# EasyEDA schematic SCH_Orto-Idroponico_2021-09-27.json
TITLE: Orto Idroponico; REV: 2.0; Date: 2021-09-27; Sheet: 1/1; Drawn By: francesco-scar; Company: Fablab Imperia
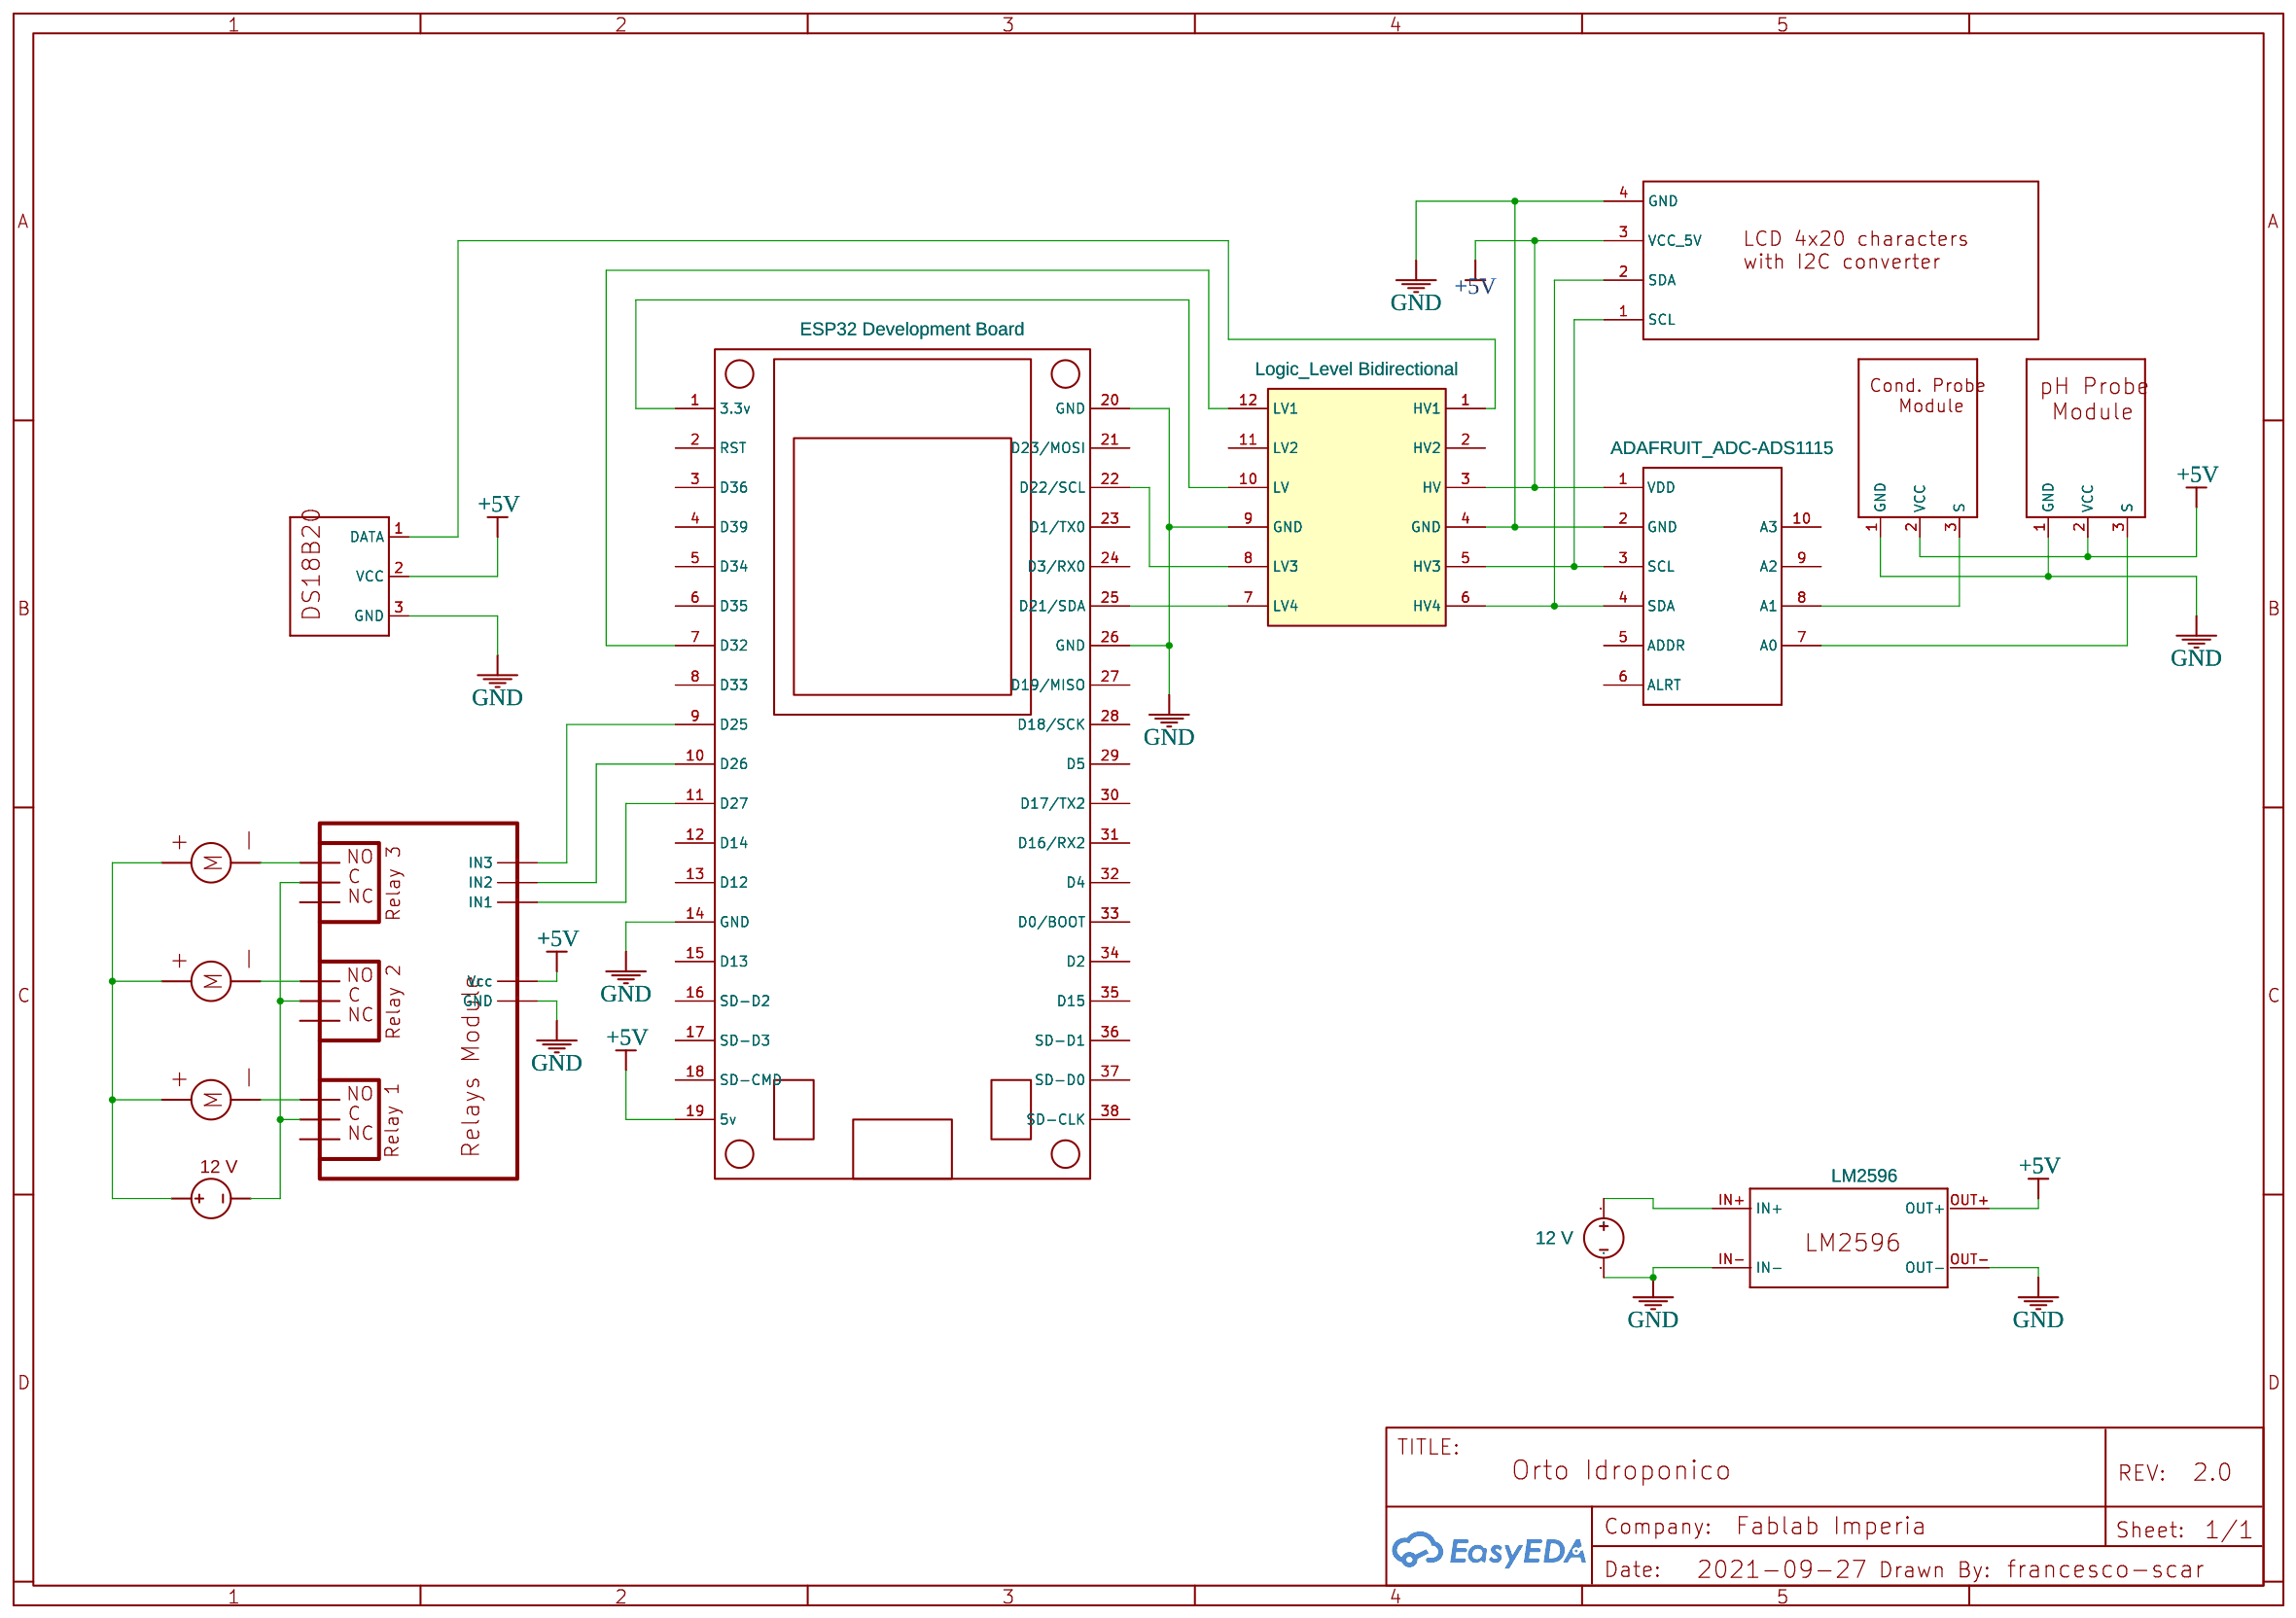
[diagram p0: schematic sheet]

## Parts
2  ADAFRUIT_ADC-ADS1115  [ADC-4CH-ADS1115]
P2  Logic_Level Bidirectional  [LOGIC_LEVEL BIDIRECTIONAL]
REG2  LM2596  [LM2596]
T1  DS18B20  [DS18B20]
T2  pH probe module  [PROBE CONNECTOR]
T3  conductivity probe module  [PROBE CONNECTOR]
U1  ESP32 Development Board  [ESP32 DEVELOPMENT BOARD ROTATED]
U2  3_RELAYS_MODULE  [8 RELAY MODULE]
U3  Nettigo LCD 4x20 I2C  [LCD 4X20 I2C]
U4  DC power source no pin  [EMPTY FOOTPRINT]
U7  DC Motor no pin  [EMPTY FOOTPRINT]
U8  DC Motor no pin  [EMPTY FOOTPRINT]
U9  DC Motor no pin  [EMPTY FOOTPRINT]
V1  12 V  [POWER PIN + -]

## Library data of the parts
2 = ADAFRUIT_ADC-ADS1115: Contributor: Contributor
P2 = Logic_Level Bidirectional: sourceId: ldJDwO6oi; Contributor: Contributor
REG2 = LM2596: Contributor: Kevin Kwok
T1 = DS18B20: Contributor: Contributor
T2 = pH probe module: Contributor: Contributor
T3 = conductivity probe module: Contributor: Contributor
U1 = ESP32 Development Board: Contributor: drfailov
U2 = 3_RELAYS_MODULE: Manufacturer Part: 3 Relays Module; Contributor: Contributor
U3 = Nettigo LCD 4x20 I2C: Manufacturer Part: 2004A; link: https://nettigo.eu/products/lcd-4x20-i2c-blue; Contributor: irukard
U4 = DC power source no pin: Contributor: Contributor
U7-U9 = DC Motor no pin: Contributor: Contributor
V1 = DC Power Source: Contributor: usauter

## Nets
+5V: 2.1(VDD) P2.3(HV) REG2.OUT+ T1.2(VCC) T2.2(VCC) T3.2(VCC) U1.19(5v) U2.10(Vcc) U3.3(VCC 5V)
GND: 2.2(GND) P2.4(GND) P2.9(GND) REG2.IN- REG2.OUT- T1.3(GND) T2.1(GND) T3.1(GND) U1.14(GND) U1.20(GND) U1.26(GND) U2.1(GND) U3.4(GND) V1.2
Net-(2-3): 2.3(SCL) P2.5(HV3) U3.1(SCL)
Net-(2-4): 2.4(SDA) P2.6(HV4) U3.2(SDA)
Net-(2-7): 2.7(A0) T2.3(S)
Net-(2-8): 2.8(A1) T3.3(S)
Net-(P2-1): P2.1(HV1) T1.1(DATA)
Net-(P2-7): P2.7(LV4) U1.25(D21/SDA)
Net-(P2-8): P2.8(LV3) U1.22(D22/SCL)
Net-(P2-10): P2.10(LV) U1.1(3.3v)
Net-(P2-12): P2.12(LV1) U1.7(D32)
Net-(REG2-IN+): REG2.IN+ V1.1
Net-(U1-9): U1.9(D25) U2.4(IN3)
Net-(U1-10): U1.10(D26) U2.3(IN2)
Net-(U1-11): U1.11(D27) U2.2(IN1)

Not connected (* = marked no-connect by the designer): 2 5(ADDR) 6(ALRT) 9(A2) 10(A3); P2 2(HV2) 11(LV2); U1 2(RST) 3(D36) 4(D39) 5(D34) 6(D35) 8(D33) 12(D14) 13(D12) 15(D13) 16(SD-D2) 17(SD-D3) 18(SD-CMD) 21(D23/MOSI) 23(D1/TX0) 24(D3/RX0) 27(D19/MISO) 28(D18/SCK) 29(D5) 30(D17/TX2) 31(D16/RX2) 32(D4) 33(D0/BOOT) 34(D2) 35(D15) 36(SD-D1) 37(SD-D0) 38(SD-CLK)
